# EAGLE design D1 - SMD (EAGLE 9.5.2)
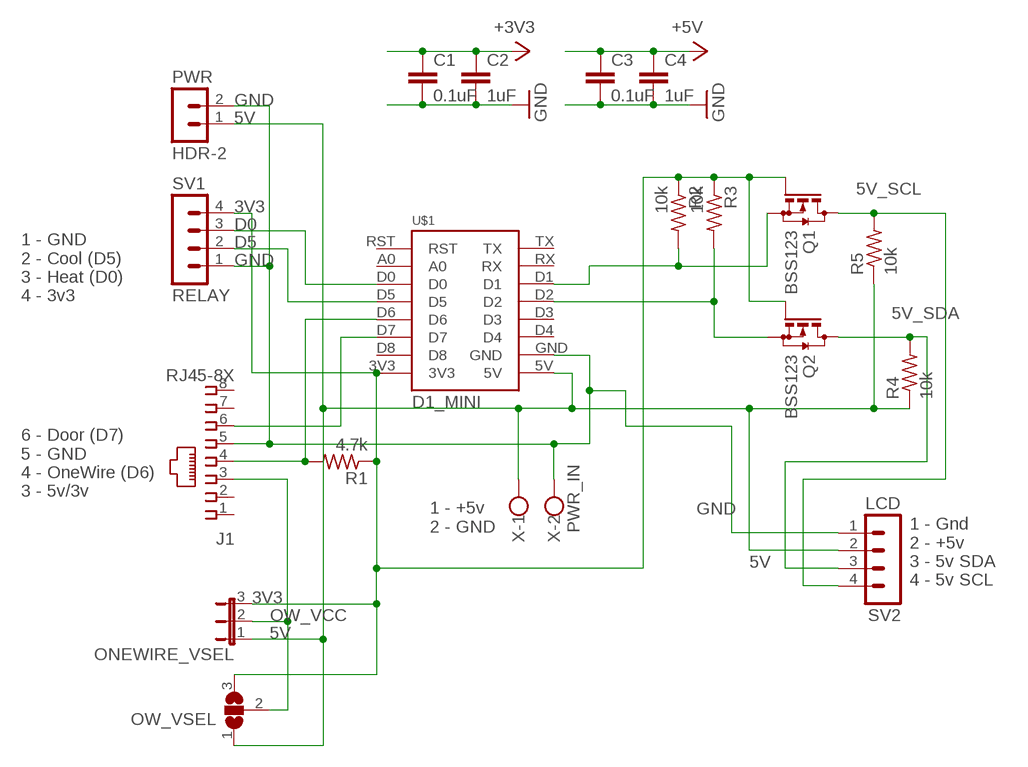
[diagram p0: schematic, sheet 1]

## Parts
C1  0.1uF  C-EUC0805  [C0805]
C2  1uF  C-EUC0805  [C0805]
C3  0.1uF  C-EUC0805  [C0805]
C4  1uF  C-EUC0805  [C0805]
J1  RJ45-8X  [RJ45-NO-SHIELD-NOLINE]
ONEWIRE_VSEL  JP2ENOLABEL  [JP2-NOLABEL]
OW_VSEL  SJ2W  [SJ_2]
PWR  HDR-2  [HDR-2_VERT]
Q1  BSS123  [SOT23]
Q2  BSS123  [SOT23]
R1  4.7k  R-US_R0805  [R0805]
R2  10k  R-US_R0805  [R0805]
R3  10k  R-US_R0805  [R0805]
R4  10k  R-US_R0805  [R0805]
R5  10k  R-US_R0805  [R0805]
SV1  RELAY  HDR-4  [HDR-4_VERT]
SV2  LCD  HDR-4  [HDR-4_VERT]
U$1  D1_MINI  WEMOSCLEAN  [WEMOS-CLEAN]
X  PWR_IN  W237-102  [W237-102]

## Nets
3V3: C1.1 C2.1 ONEWIRE_VSEL.3 OW_VSEL.3 Q1.1(G) Q2.1(G) R1.1 R2.1 R3.1 SV1.4 U$1.3V3 ; supply symbol labelled +3V3
3V3_SCL: Q1.2(S) R2.2 U$1.D1
3V3_SDA: Q2.2(S) R3.2 U$1.D2
5V [5v]: C3.1 C4.1 ONEWIRE_VSEL.1 OW_VSEL.1 PWR.1 R4.1 R5.1 SV2.2 U$1.5V X.1 ; supply symbol labelled +5V
5V_SCL: Q1.3(D) R5.2 SV2.4
5V_SDA: Q2.3(D) R4.2 SV2.3
D0: SV1.3 U$1.D0
D5: SV1.2 U$1.D5
D6: J1.4 R1.2 U$1.D6
D7: J1.6 U$1.D7
GND [Gnd]: C1.2 C2.2 C3.2 C4.2 J1.5 PWR.2 SV1.1 SV2.1 U$1.GND X.2
OW_VCC: J1.3 ONEWIRE_VSEL.2 OW_VSEL.2
Unconnected: J1.1 J1.2 J1.7 J1.8 U$1.A0 U$1.D3 U$1.D4 U$1.D8 U$1.RST U$1.RX U$1.TX

## Notes on the sheet
- 1 - GND
  2 - Cool (D5)
  3 - Heat (D0)
  4 - 3v3
- 6 - Door (D7)
  5 - GND
  4 - OneWire (D6) 
  3 - 5v/3v
- 1 - +5v
  2 - GND
- 1 - Gnd
  2 - +5v
  3 - 5v SDA
  4 - 5v SCL

## Library data of the parts
C1-C4 = rcl:C-EU: CAPACITOR, European symbol; SPICEPREFIX: C
J1 = con-tycoelectronics:RJ45: CORCOM Modular RJ Jacks No Shield Source: www.tycoelectronics.com .. ENG_DS_1654001_1099_RJ_L_0507.pdf; MPN: RJ45-8X; OC_FARNELL: unknown; OC_NEWARK: 16R6101
ONEWIRE_VSEL = Donnie:JP2E: JUMPER
OW_VSEL = jumper:SJ2W: SMD solder JUMPER
PWR = Donnie:HDR-2
Q1 Q2 = transistor-small-signal:BSS123: N-CHANNEL MOS FET
R1-R5 = rcl:R-US_: RESISTOR, American symbol
SV1 SV2 = Donnie:HDR-4: PIN HEADER
U$1 = 1455413453956-wemos:WEMOS: LoLin D1 Mini controller socket
X = con-wago-500:W237-102: WAGO SCREW CLAMP; MPN: 237-102; OC_FARNELL: unknown; OC_NEWARK: 70K9898

## Net classes
0 default: width 0.305 mm, clearance 0.305 mm
1 5v: width 0.406 mm, clearance 0.406 mm
2 3v: width 0.406 mm, clearance 0.406 mm
3 Gnd: width 0.406 mm, clearance 0.406 mm

## Board
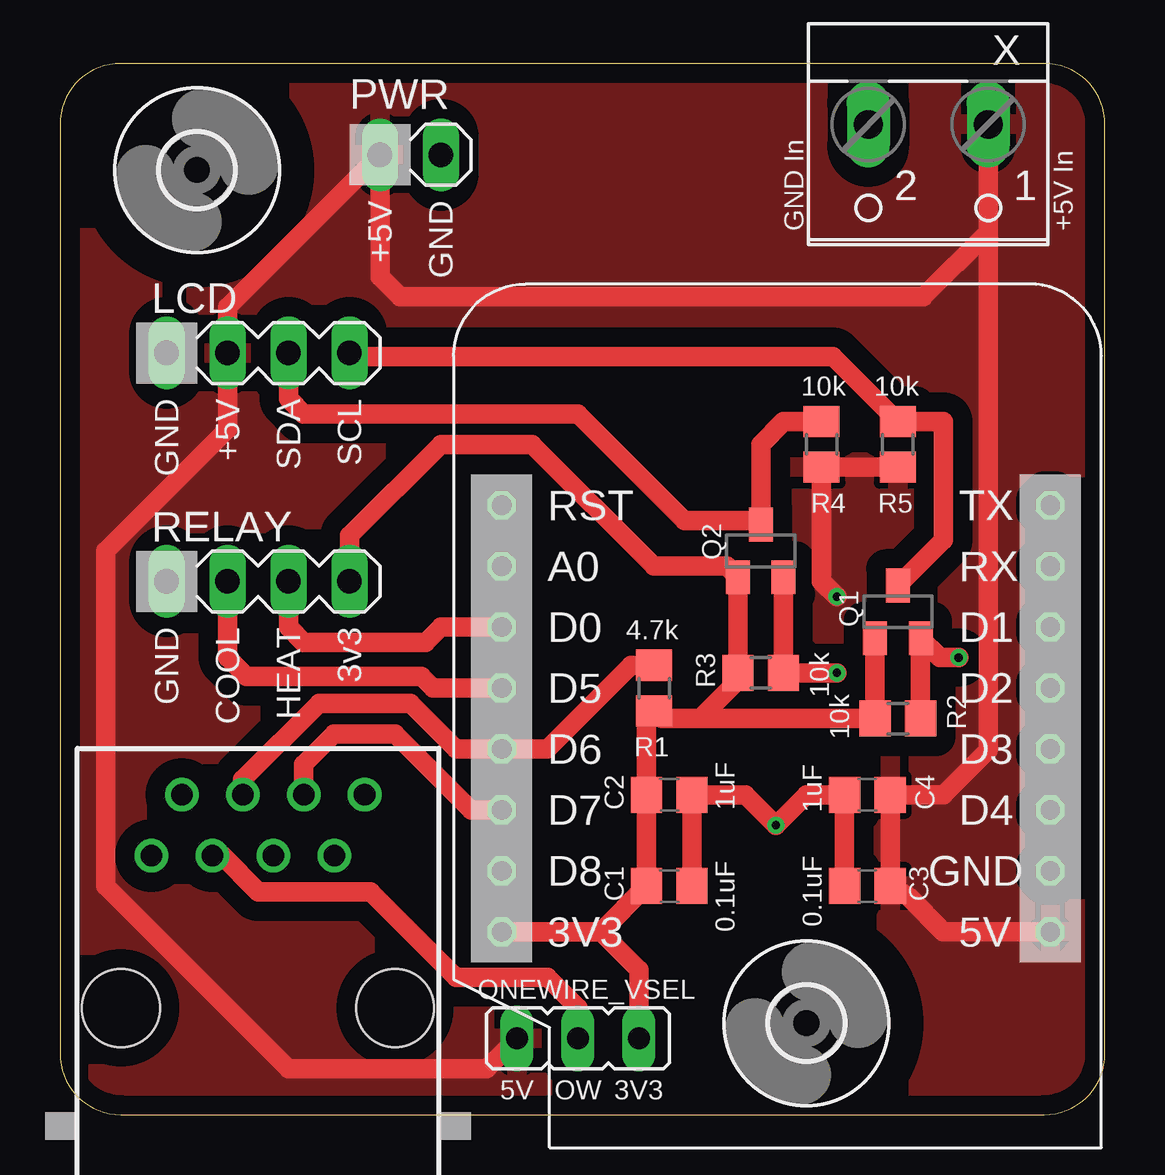
[diagram p1: board, top side]
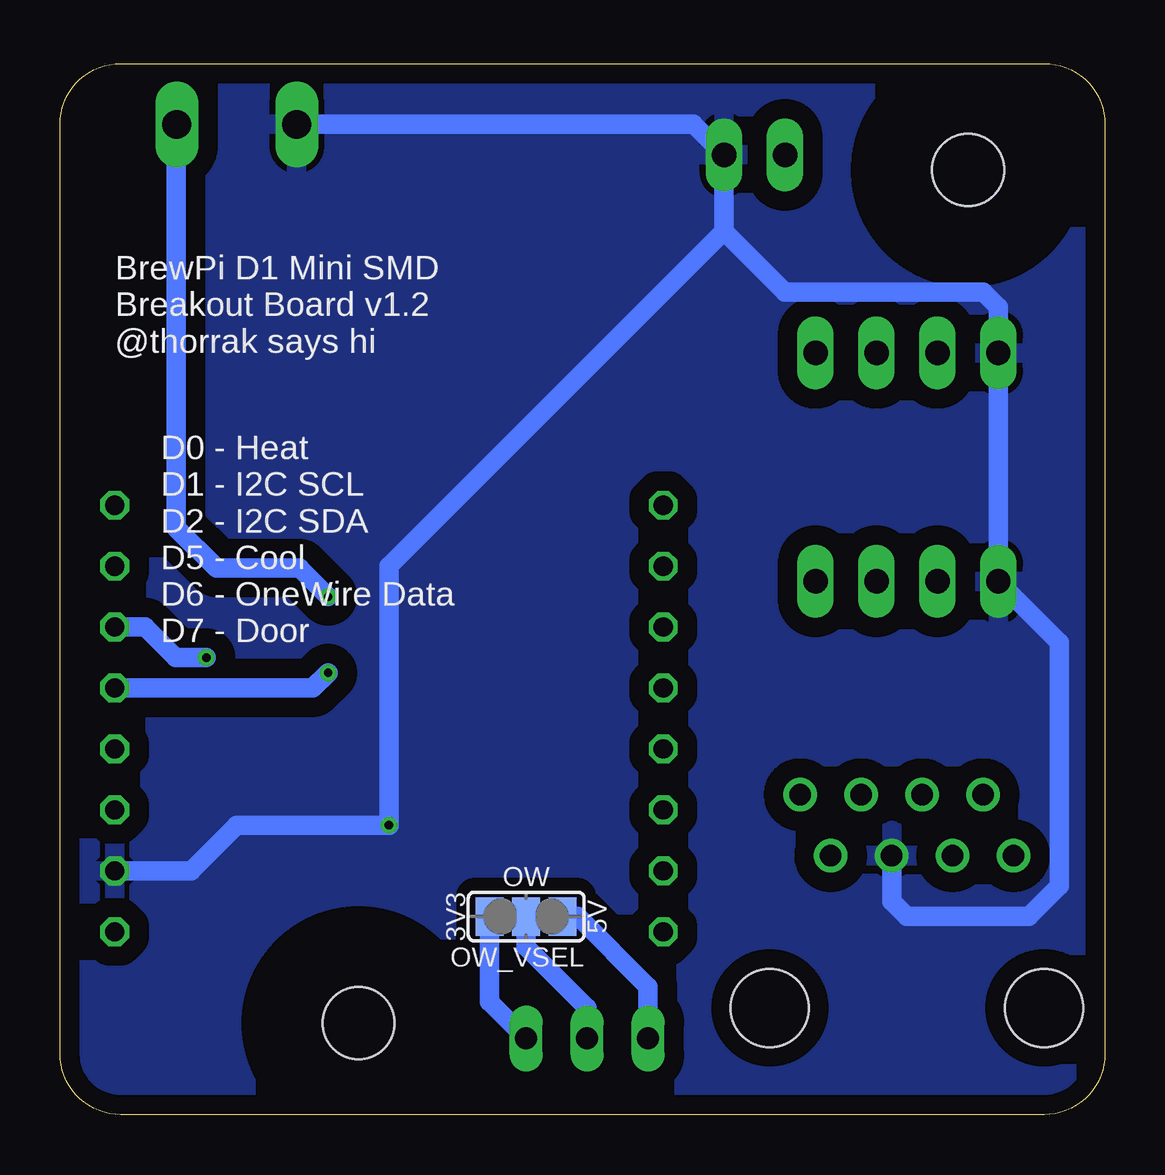
[diagram p2: board, bottom side, seen from below]

Size 43.56 x 43.81 mm. Coordinates in mm from the lower left corner, seen from the top.
Outline: 0,41.27 0,2.54 arc90 2.54,0 41.02,0 arc90 43.56,2.54 43.56,41.27 arc90 41.02,43.81 2.54,43.81 arc90 0,41.27
Copper layers (1*16): Top 0.0356mm / dielectric 1.5011mm / Bottom 0.0356mm
Design rules "PCBs_io": minimum track width 6mil, minimum drill 13mil, track to track 6mil, track to pad 6mil, pad to pad 6mil, via to via 6mil, smd to smd 6mil, copper to edge 15mil, drill to drill 6mil, minimum pad ring 7mil, minimum via ring 7mil, stop-mask expansion 3mil, vias tented up to drill 0mil, thermal gap 10mil

### Footprints (pad centres in the part's own frame; a part is rotated, then mirrored left to right if it is on the bottom)
C0805 = smd 1.3 x 1.5: 1 -0.95,0; 2 0.95,0
RJ45-NO-SHIELD-NOLINE = drill 0.9 pad 1.4: 1 -4.445,6.35; 2 -3.175,8.89; 3 -1.905,6.35; 4 -0.635,8.89; 5 0.635,6.35; 6 1.905,8.89; 7 3.175,6.35; 8 4.445,8.89 | hole 3.251: -5.715,0; 5.715,0
JP2-NOLABEL = drill 0.914 long: 1 -2.54,0; 2 0,0; 3 2.54,0
SJ_2 = smd 1.168 x 1.6: 1 -1.524,0; 2 0,0; 3 1.524,0
HDR-2_VERT = drill 1.016 long: 1 0,0; 2 2.54,0
SOT23 = smd 1 x 1.4: 1 -0.95,-1.1; 2 0.95,-1.1; 3 0,1.1
R0805 = smd 1.3 x 1.5: 1 -0.95,0; 2 0.95,0
HDR-4_VERT = drill 1.016 long: 1 0,0; 2 2.54,0; 3 5.08,0; 4 7.62,0
WEMOS-CLEAN = drill 0.8 octagon: 3V3 0,0; 5V 22.86,0; A0 0,15.24; D0 0,12.7; D1 22.86,12.7; D2 22.86,10.16; D3 22.86,7.62; D4 22.86,5.08; D5 0,10.16; D6 0,7.62; D7 0,5.08; D8 0,2.54; GND 22.86,2.54; RST 0,17.78; RX 22.86,15.24; TX 22.86,17.78
3,0 = hole 3: 0,0
W237-102 = drill 1.194 long: 1 -2.5,-1.27; 2 2.5,-1.27

### Placement (x,y rotation side)
C1  25.4,9.53 0 top
C2  25.4,13.33 0 top
C3  33.65,9.53 180 top
C4  33.65,13.33 180 top
J1  8.25,4.44 0 top
ONEWIRE_VSEL  21.59,3.18 0 top
OW_VSEL  24.13,8.25 180 bottom
PWR  13.34,40 0 top
Q1  34.93,20.96 0 top
Q2  29.21,23.5 0 top
R1  24.76,17.78 90 top
R2  34.93,16.51 0 top
R3  29.21,18.42 0 top
R4  31.75,27.94 90 top
R5  34.93,27.94 90 top
SV1  4.45,22.22 0 top
SV2  4.45,31.75 0 top
U$1  18.41,7.62 0 top
U$2  [3,0]  5.71,39.37 0 top
U$4  [3,0]  31.12,3.81 0 top
X  36.2,40 180 top

### Tracks (layer width: path | path; a pad name or v marks a point on that pad's centre or on a via)
3V3
  Top 0.813: 26.67,16.51 25.09,16.51 R1.1 24.45,16.51 C2.1 C1.1 22.54,7.62 | Q1.1 R2.1 26.67,16.51 | 26.67,16.51 28.26,18.1 R3.1 Q2.1 27.79,22.86 24.76,22.86 19.68,27.94 15.88,27.94 12.06,24.13 SV1.4 | U$1.3V3 22.54,7.62 | ONEWIRE_VSEL.3 24.13,6.04 22.54,7.62
  Bottom 0.813: ONEWIRE_VSEL.3 25.65,4.7 OW_VSEL.3
3V3_SCL  (via drill 0.35)
  Top 0.813: R2.2 Q1.2 36.68,19.05 v37.46,19.05
  Bottom 0.813: U$1.D1 40.01,20.32 38.73,19.05 v37.46,19.05
3V3_SDA  (via drill 0.35)
  Top 0.813: Q2.2 R3.2 v32.38,18.42
  Bottom 0.813: U$1.D2 33.02,17.78 v32.38,18.42
5V  (via drill 0.35)
  Top 0.813: U$1.5V 36.83,7.62 35.38,9.07 C3.1 C4.1 36.83,13.33 38.7,15.2 38.7,36.79 | v32.38,21.59 31.75,22.22 R4.1 R5.1 | 38.7,36.79 35.99,34.09 14.17,34.09 13.34,34.92 PWR.1 6.98,33.66 SV2.2 6.98,28.57 1.9,23.5 1.9,9.53 9.52,1.9 17.78,1.9 ONEWIRE_VSEL.1 | X.1 38.7,36.79
  Bottom 0.813: v32.38,21.59 33.57,22.78 37.04,22.78 38.71,24.45 38.71,41.26 X.1 | ONEWIRE_VSEL.1 19.05,5.33 21.97,8.25 OW_VSEL.1
  pour Top (isolate 0.813): 0,43.81 43.81,43.81 43.81,0 0,0
5V_SCL
  Top 0.813: SV2.4 12.06,31.6 32.22,31.6 R5.2 36.83,28.89 36.83,23.96 Q1.3
5V_SDA
  Top 0.813: R4.2 30.16,28.89 29.21,27.94 Q2.3 29.04,24.76 26.04,24.76 21.59,29.21 10.16,29.21 9.52,29.85 SV2.3
D0
  Top 0.813: U$1.D0 15.88,20.32 15.24,19.68 10.16,19.68 9.52,20.32 SV1.3
D5
  Top 0.813: U$1.D5 15.55,17.78 15.07,18.26 7.77,18.26 6.98,19.05 SV1.2
D6
  Top 0.813: R1.2 23.81,18.73 20.32,15.24 U$1.D6 16.51,15.24 14.6,17.14 10.79,17.14 7.62,13.97 J1.4
D7
  Top 0.813: J1.6 10.16,14.61 11.43,15.87 13.97,15.87 17.14,12.7 U$1.D7
GND  (via drill 0.35)
  Top 0.813: C3.2 C4.2 31.12,13.33 v29.84,12.07 28.57,13.33 C2.2 C1.2
  Bottom 0.813: U$1.GND 38.1,10.16 36.2,12.07 v29.84,12.07 29.84,22.86 15.88,36.83 | 15.88,36.83 13.34,34.29 5.08,34.29 4.45,33.66 SV2.1 SV1.1 1.9,19.68 1.9,9.53 3.17,8.25 8.25,8.25 8.89,8.89 J1.5 | 15.88,36.83 PWR.2 17.14,41.27 X.2
  pour Bottom (isolate 0.813): 0,43.81 43.81,43.81 43.81,0 0,0
OW_VCC
  Top 0.813: J1.3 6.75,10.79 8.26,9.28 12.94,9.28 16.51,5.71 20.32,5.71 21.59,4.44 ONEWIRE_VSEL.2
  Bottom 0.813: ONEWIRE_VSEL.2 21.59,4.44 24.13,6.99 OW_VSEL.2

### Text on the board
tPlace: +5V | GND | GND In | +5V In | GND | +5V | SDA | SCL | GND | COOL | HEAT | 3v3
tNames: 5V | OW | 3V3
bNames: BrewPi D1 Mini SMD / Breakout Board v1.2 / @thorrak says hi | D0 - Heat / D1 - I2C SCL / D2 - I2C SDA / D5 - Cool / D6 - OneWire Data / D7 - Door | OW | 5V | 3V3